# Altium schematic sheet ZUM_Power.SchDoc: ZUM_Junior_Power
size A4; Author: Andrés Gullón; DocumentNumber: 4; Revision: 1.G.3; SheetNumber: 4; SheetTotal: 6
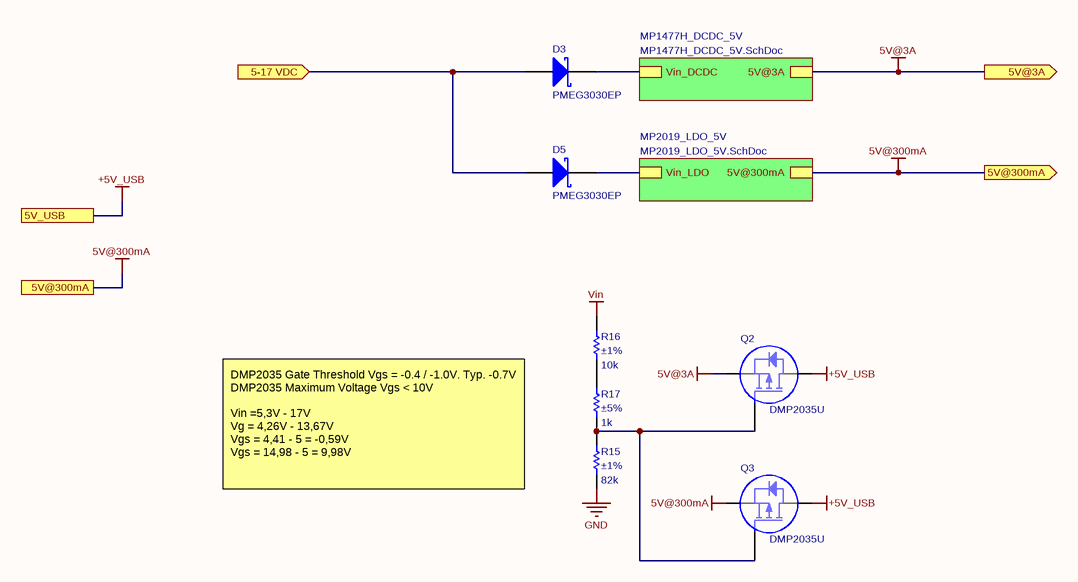
[diagram p0: ZUM_Power.SchDoc]

## Parts
D3  PMEG3030EP  [SOD128]
D5  PMEG3030EP  [SOD128]
Q2  DMP2035U  [SOT23-3]
Q3  DMP2035U  [SOT23-3]
R15  Tolerance: ±1%  Resistance: 82k  [R0402]  (hidden comment: R0402_82k_0.063W_±1%)
R16  Tolerance: ±1%  Resistance: 10k  [R0402]  (hidden comment: R0402_10k_0.063W_±1%)
R17  Tolerance: ±5%  Resistance: 1k  [R0402]  (hidden comment: R0402_1k_0.063W_±5%)

## Sub-sheets
MP1477H_DCDC_5V = MP1477H_DCDC_5V.SchDoc: Vin_DCDC, 5V@3A
MP2019_LDO_5V = MP2019_LDO_5V.SchDoc: Vin_LDO, 5V@300mA

## Ports
5-17 VDC (in), 5V@3A (out), 5V@300mA, 5V@300mA (out), 5V_USB

## Nets
5V@3A: Q2.2(S) ; port 5V@3A, sheet MP1477H_DCDC_5V/5V@3A
5V@300mA: Q3.2(S) ; port 5V@300mA, sheet MP2019_LDO_5V/5V@300mA
+5V_USB: Q2.3(D) Q3.3(D) ; port 5V_USB
GND: R15.1
Vin: R16.1
5-17 VDC: D3.A D5.A ; port 5-17 VDC
NetD3_k: D3.k(K) ; sheet MP1477H_DCDC_5V/Vin_DCDC
NetD5_k: D5.k(K) ; sheet MP2019_LDO_5V/Vin_LDO
NetQ2_1: Q2.1(G) Q3.1(G) R15.2 R17.1
NetR16_2: R16.2 R17.2

## Notes on the sheet
- DMP2035 Gate Threshold Vgs = -0.4 / -1.0V. Typ. -0.7V
  DMP2035 Maximum Voltage Vgs < 10V
  Vin =5,3V - 17V
  Vg = 4,26V - 13,67V
  Vgs = 4,41 - 5 = -0,59V
  Vgs = 14,98 - 5 = 9,98V
- Title
- Project
- Size:
- Author
- A4
- Number:
- Revision:
- Mundo Reader, S.L. This project and all the sheets and layouts enclosed are licensed under Creative Commons by Attribution and Share Alike [CC BY-SA] (www.creativecommons.com)
- Date:
- Time:
- Sheet
- of

## Library data of the parts
D3 D5 = CMP-A2309-1: Schottky Diode; Manufacturer: NXP; Ifor: 3A; Vrrm: 30V; Ifsm: 50A; Vf: 0,36V; Description ES: Diodo Schottky; Temp_Max: 150; Temp_Min: -55; Lead time: 3 wks; Value: 3A 30V; SchLibComponentName: Schottky; Part Number: PMEG3030EP; OrderingCode: PMEG3030EP; Price units: EUR
Q2 Q3 = CMP-A2378-1: P-MOSFET transistor; Manufacturer: Diodes Incorporated; SchLibComponentName: Mosfet_P; Vds: 20V; Vgss: 8V; Id: 3,6A; OrderingCode: DMP2035U-7; Description ES: Transistor MOSFET de canal P; Temp_ Max: 150; Temp_ Min: -55; Lead time: 6 wks; Part Number: DMP2035U; Supplier cod: AC1190; Price units: EUR
R15 = CMP-A1992-3: Manufacturer: Vishay; OrderingCode: CRCW040282K0FK; Power: 0.063W; Value: 82k ±1% 0.063W; Temp_ Max: 155; Temp_ Min: -55; Description ES: Resistencia; OrderingCode 2: RC0402FR-0782KL; SchLibComponentName: Resistor; PackageDescription: SMD; Part Number: R0402_82k_0.063W_±1%; Price units: EUR; Manufacturer 2: Yageo
R16 = CMP-A1837-1: Manufacturer: Vishay; SchLibComponentName: Resistor; OrderingCode: CRCW040210K0FK; Power: 0.063W; Value: 10k ±1% 0.063W; Temp_ Max: 155; Temp_ Min: -55; PackageDescription: SMD; Part Number: R0402_10k_0.063W_±1%; Price units: EUR
R17 = CMP-A1718-3: Manufacturer: Vishay; OrderingCode: CRCW04021K00JN; Power: 0.063W; Value: 1k ±5% 0.063W; Temp_ Max: 155; Temp_ Min: -55; Description ES: Resistencia; SchLibComponentName: Resistor; PackageDescription: SMD; Part Number: R0402_1k_0.063W_±5%; Price units: EUR